# Altium schematic sheet SENSOR.SchDoc: =ProjectName
size A4; CheckedBy: DatNB; Author: Ven; CompanyName: Nacentech; Organization: IMET
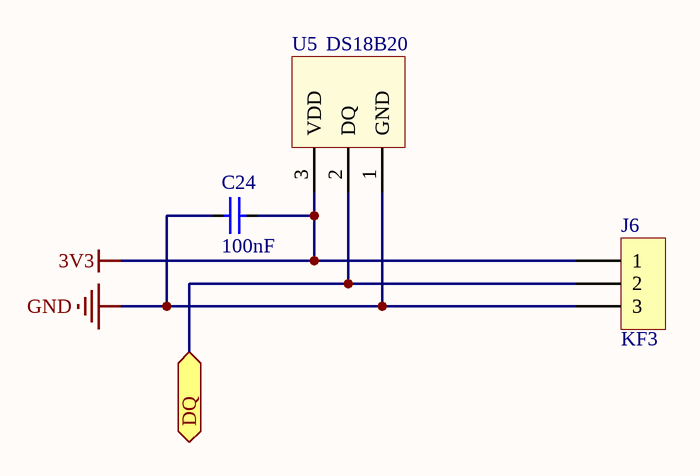
[diagram p0: SENSOR.SchDoc]

## Parts
C24  100nF  [CAP_0805]
J6  KF3  [KF3-5.08]
U5  DS18B20  [QTO-92A]

## Ports
DQ (bidir)

## Nets
3V3: C24.1 J6.1 U5.3(VDD)
GND: C24.2 J6.3 U5.1(GND)
DQ: J6.2 U5.2(DQ) ; port DQ

## Notes on the sheet
- Project:
- Page Contents:
- Size:
- Date:
- A4
- Checked by:
- Time:
- Revision:
- Sheet
- of
- File:

## Library data of the parts
C24 = CapSMD: Capacitor; Value: 33p; Published: 8-Jun-2000; LatestRevisionDate: 17-Jul-2002; LatestRevisionNote: Re-released for DXP Platform.; PackageReference: RAD-0.3; Publisher: Altium Limited
J6 = KF3: Manufacturer: Würth Elektronik eiSos GmbH; partNo: 691103110003; ComponentLink1 Description: Manufacturer; ComponentLink2 Description: Datasheet; NoPins: 3; Created Date: 29 October 2013; ComponentLink1URL: http://www.we-online.com; ComponentLink2URL: http://katalog.we-online.de/em/datasheet/6911031100xx.pdf; Created by: Karrer Zheng
U5 = DS18B20: High Precision  1-Wire® Digital Thermometer